# Altium schematic sheet Persephone_cover.SchDoc
size 393 x 281 mm; SheetNumber: 1; SheetTotal: 1
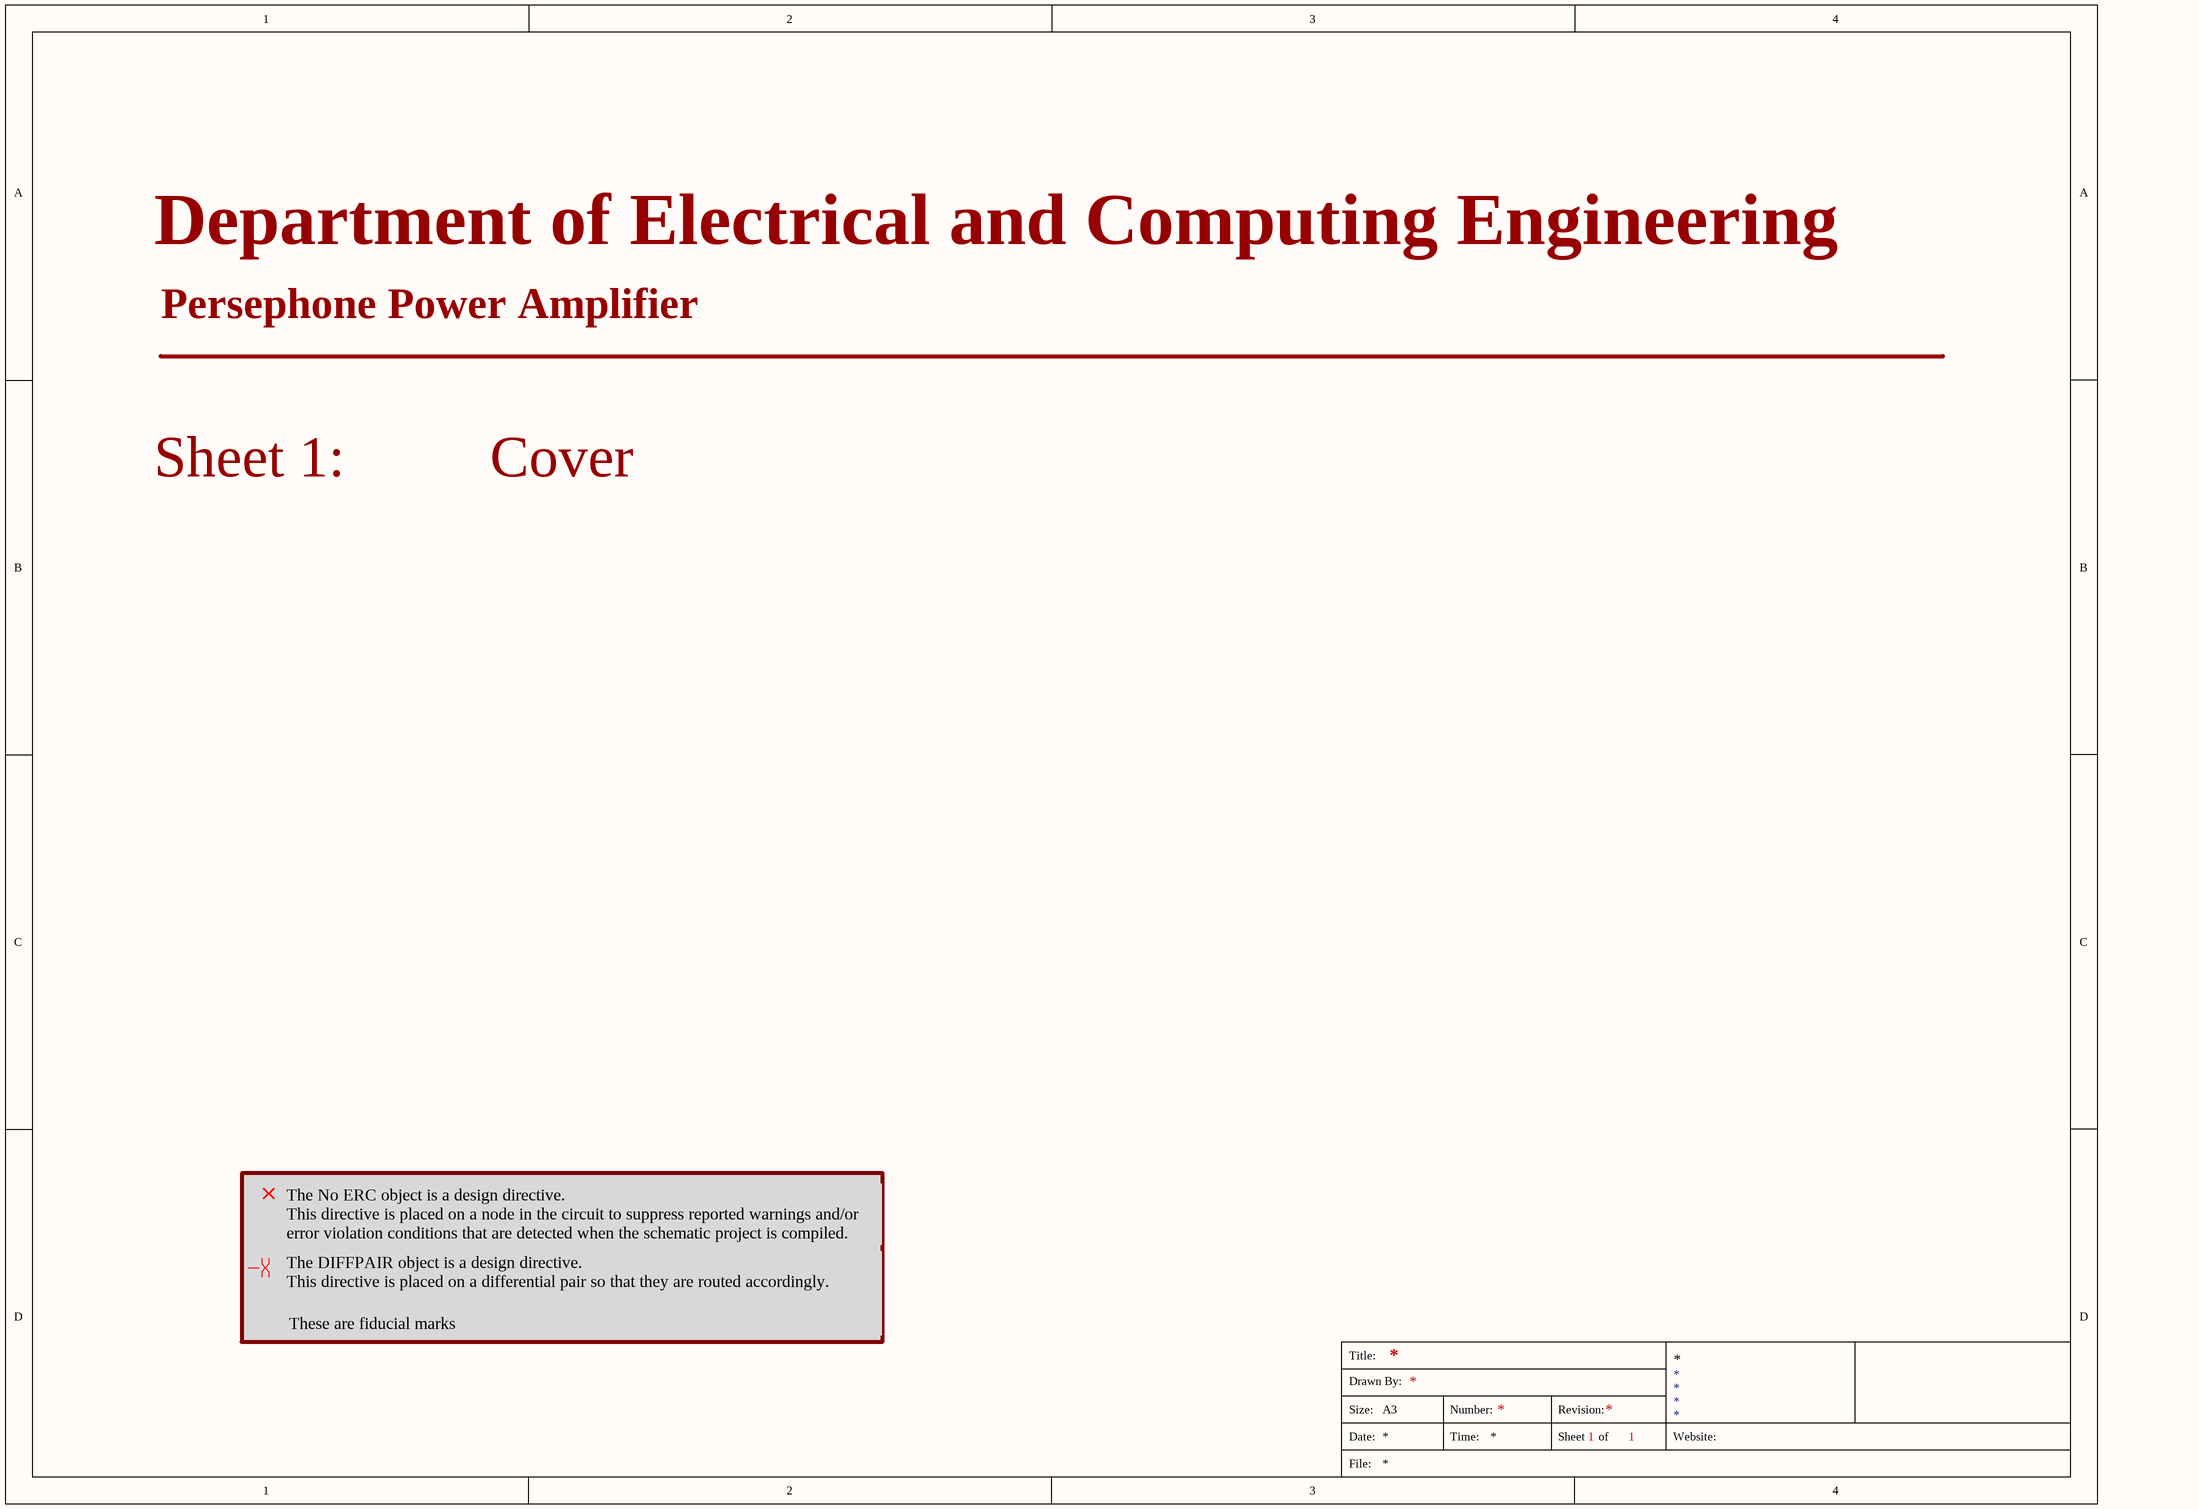
[diagram p0: Persephone_cover.SchDoc]

## Layout directives
differential pair: (no net found under the mark)

## Notes on the sheet
- Department of Electrical and Computing Engineering
- Persephone Power Amplifier
- Sheet 1:          Cover
- The No ERC object is a design directive.
  This directive is placed on a node in the circuit to suppress reported warnings and/or error violation conditions that are detected when the schematic project is compiled.
- The DIFFPAIR object is a design directive.
  This directive is placed on a differential pair so that they are routed accordingly.
- These are fiducial marks
- Title:
- Drawn By:
- Size:
- Date:
- File:
- A3
- Number:
- Time:
- Revision:
- Sheet
- of
- Website: